# Altium schematic sheet Display.SchDoc: Display
size 840 x 593 mm; Author: James Bao; SheetNumber: 3; SheetTotal: 3
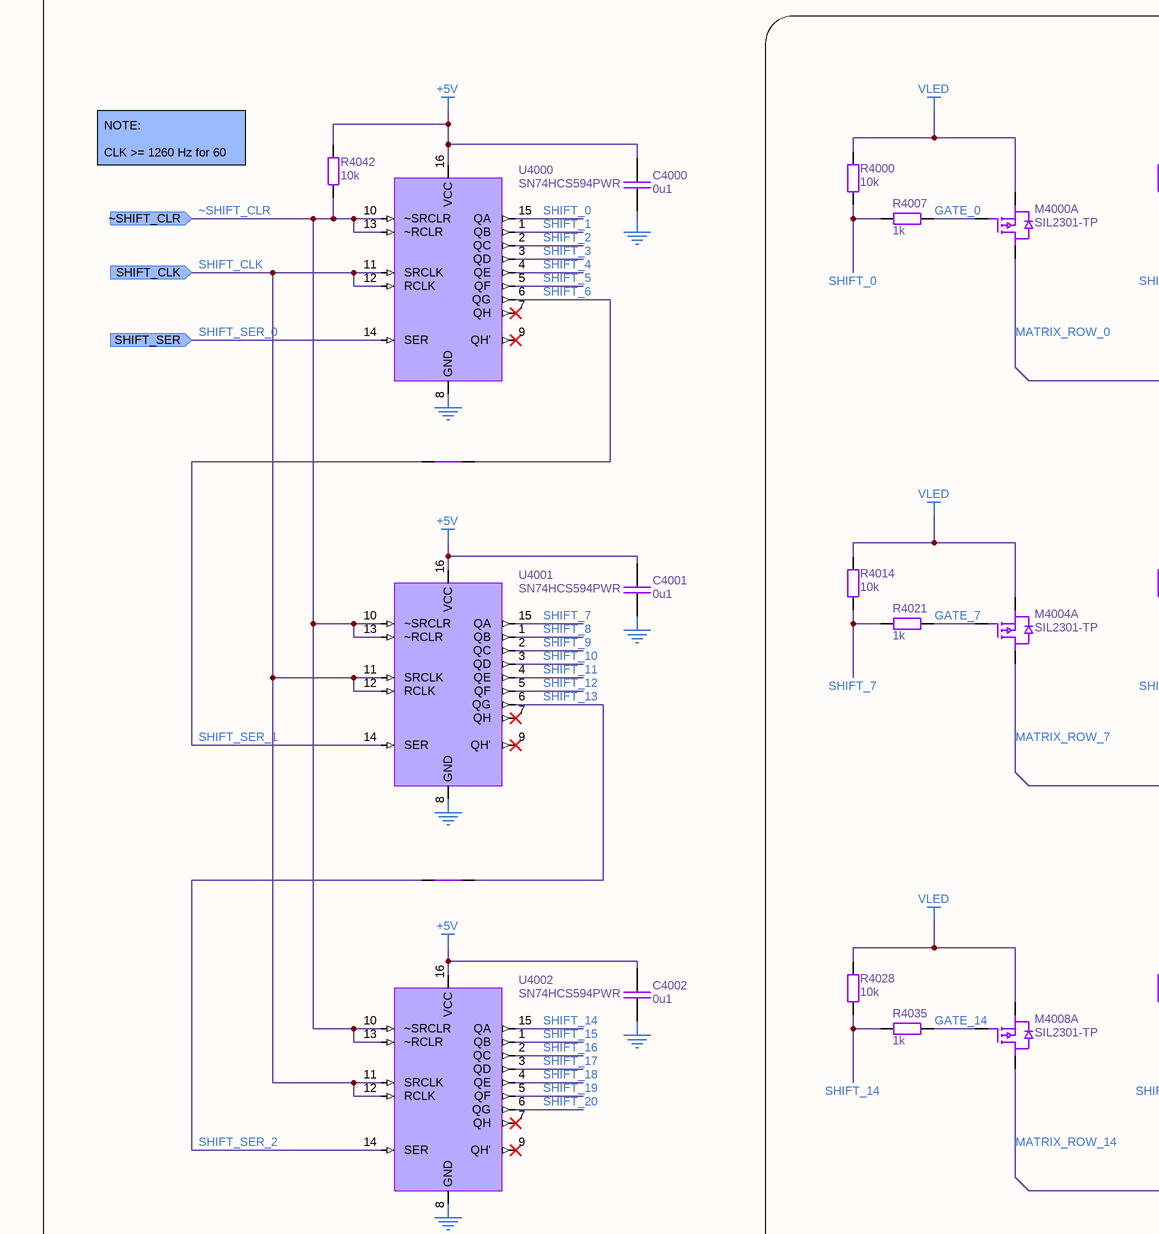
[diagram p0: Display.SchDoc, top left]
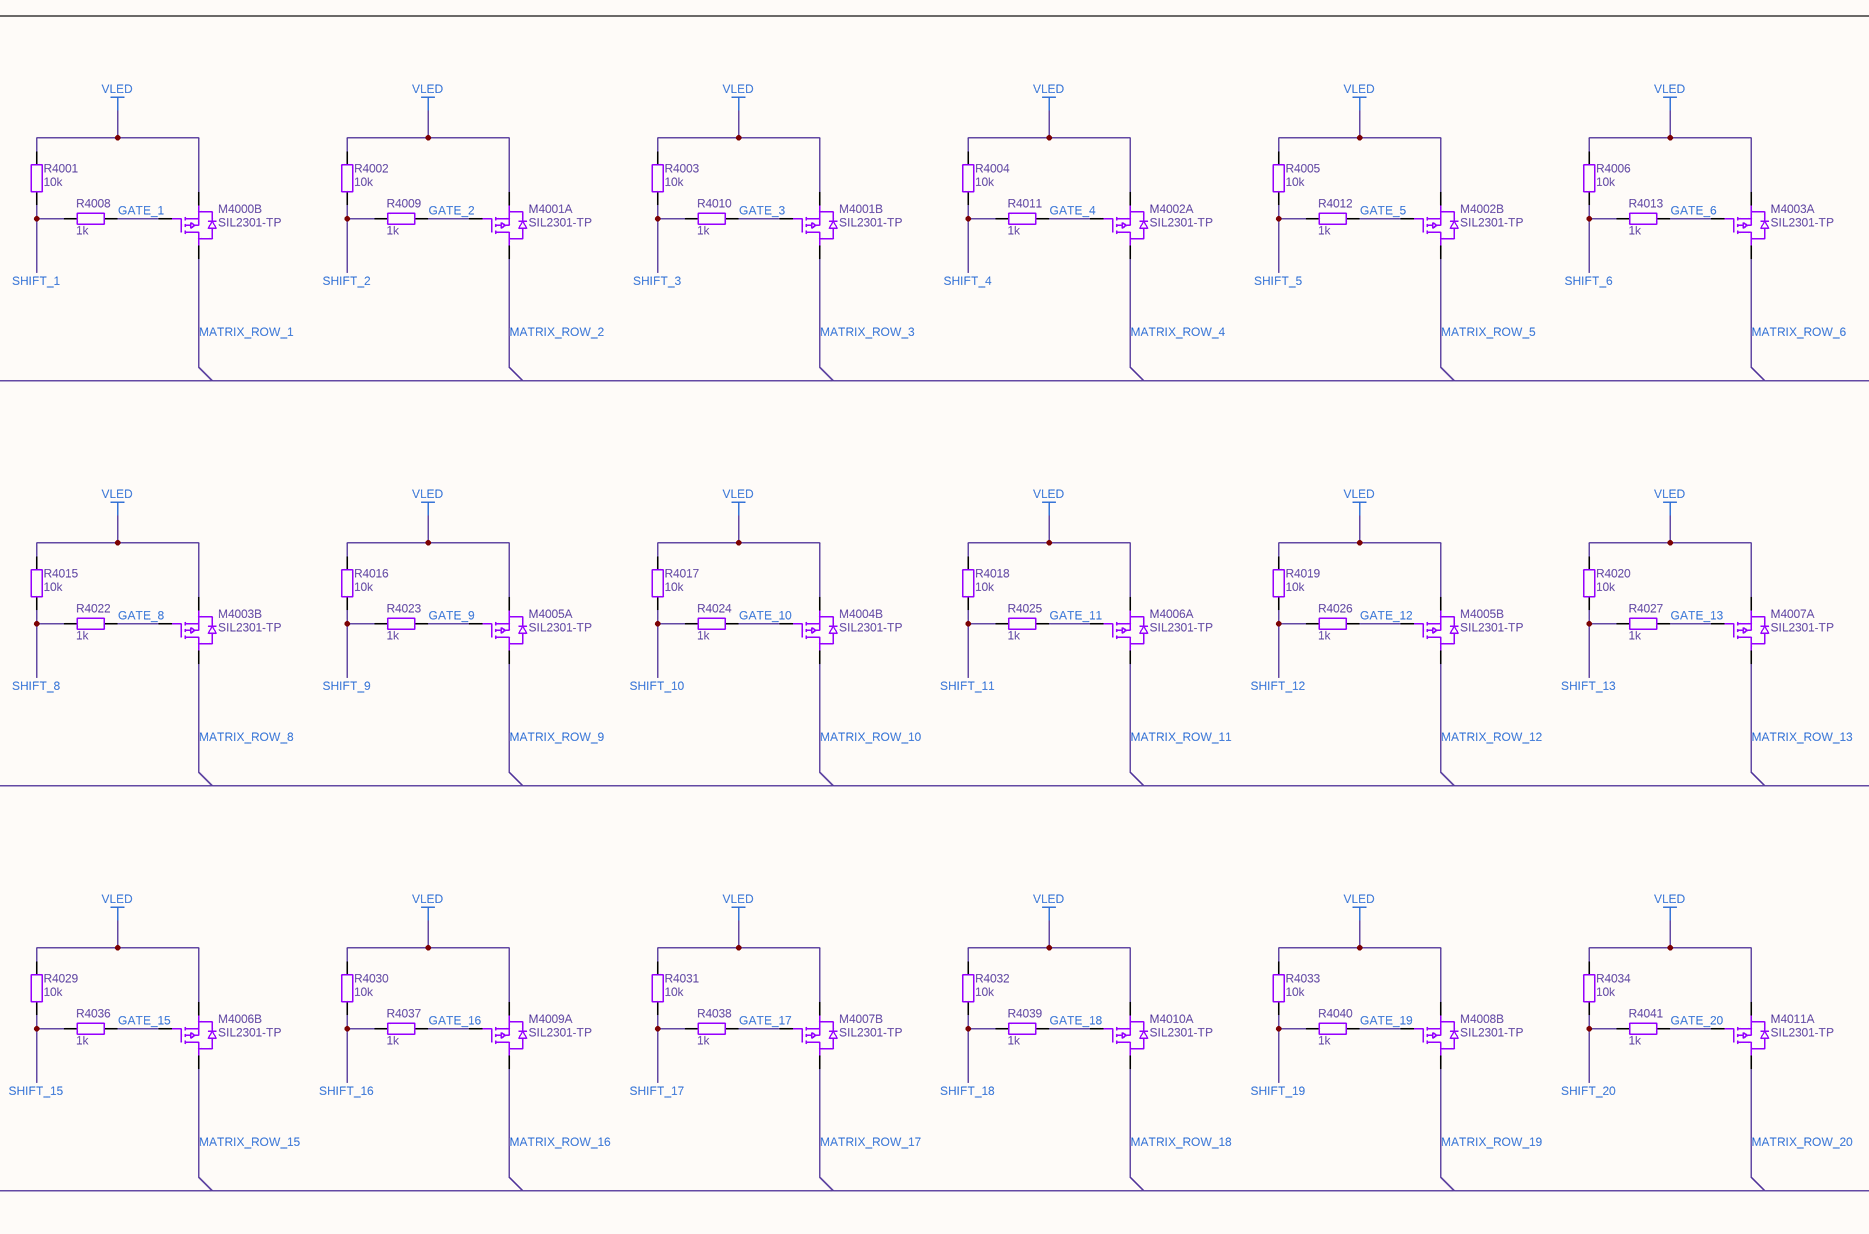
[diagram p1: Display.SchDoc, top middle]
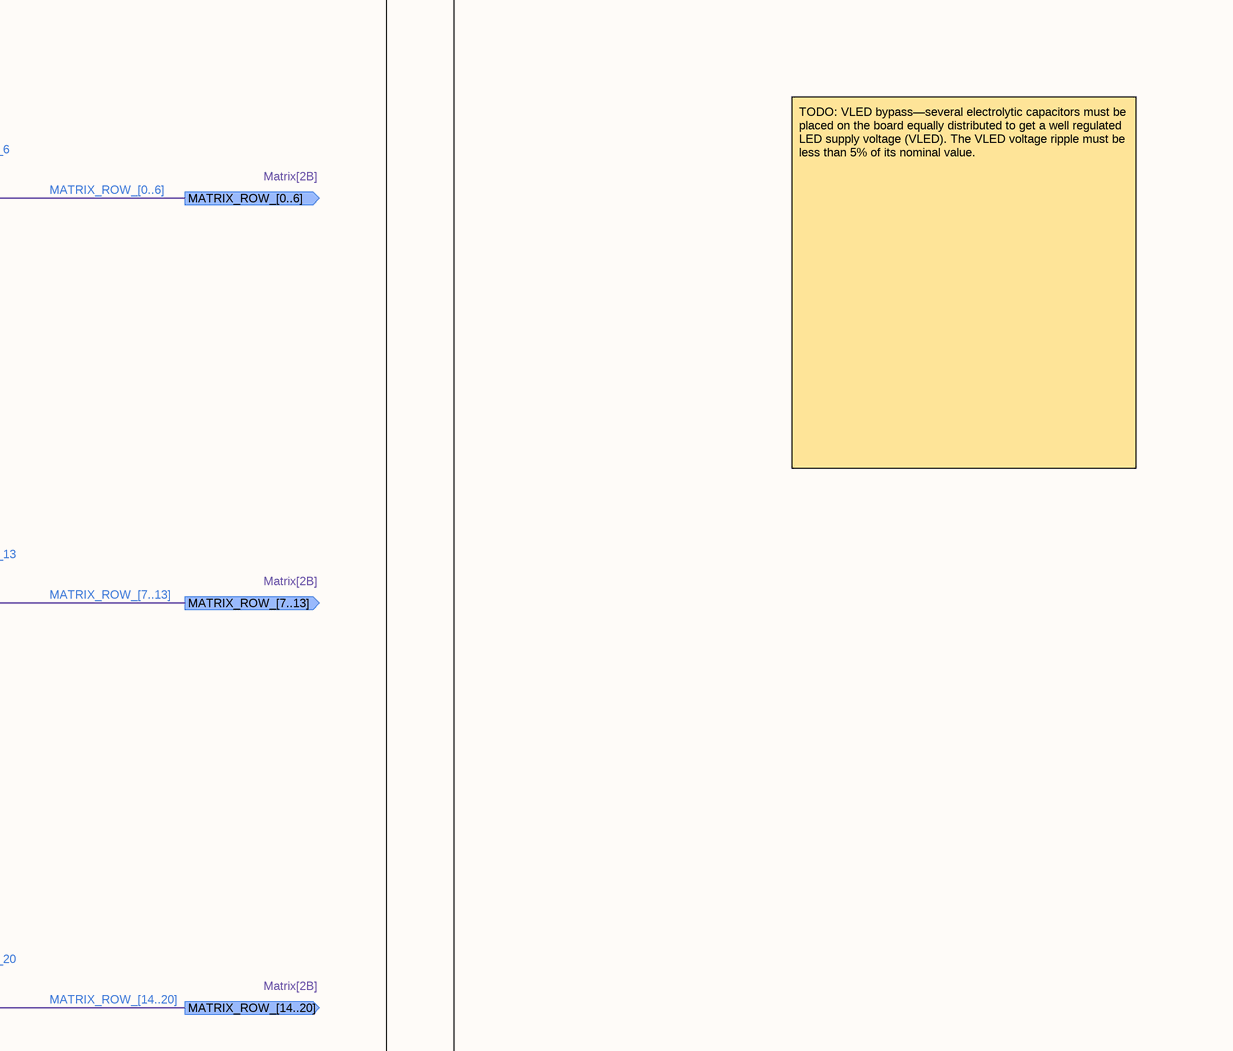
[diagram p2: Display.SchDoc, top right]
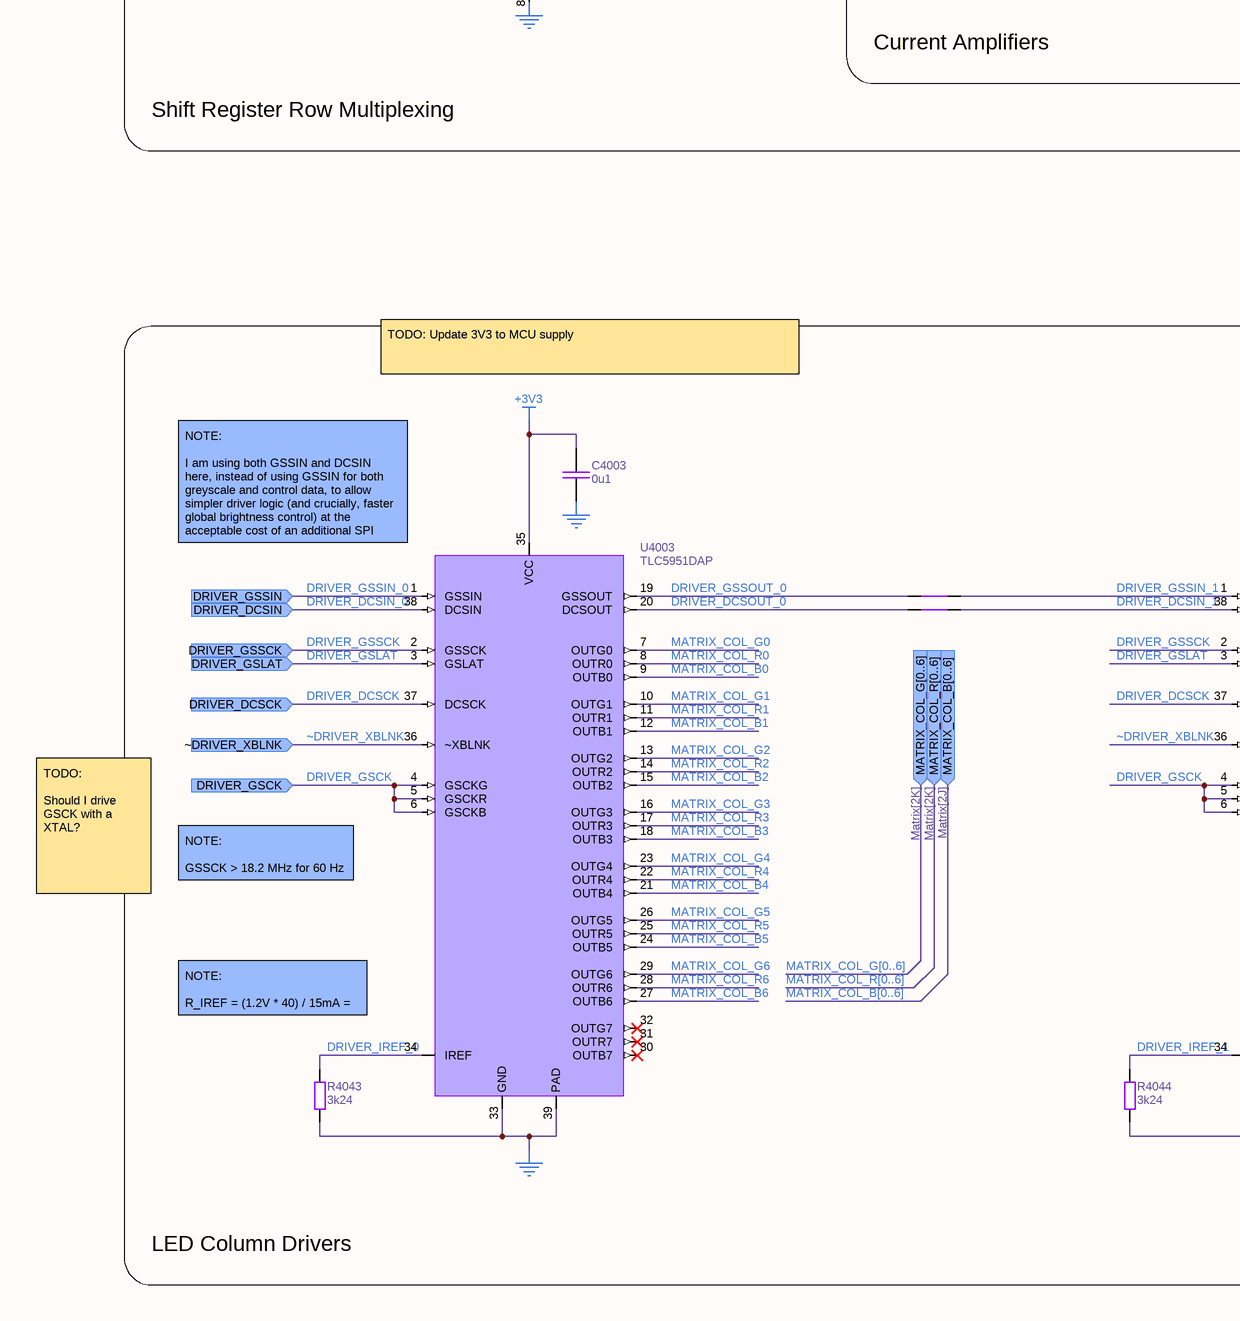
[diagram p3: Display.SchDoc, bottom left]
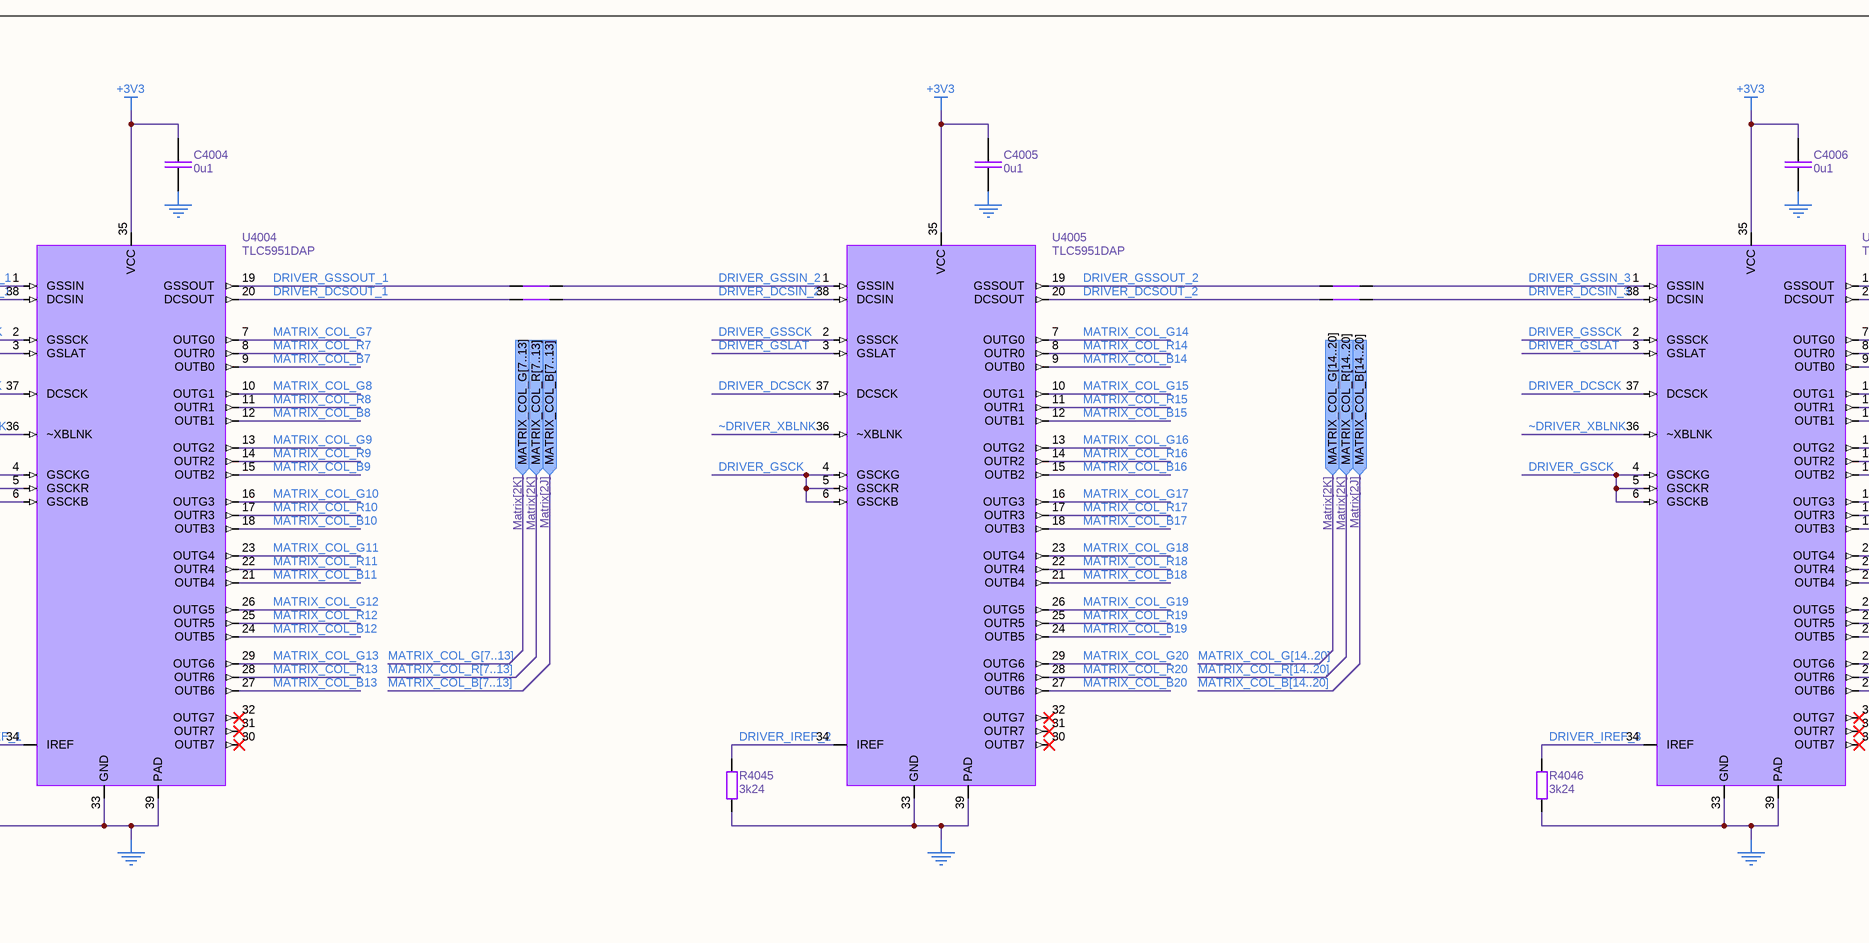
[diagram p4: Display.SchDoc, bottom middle]
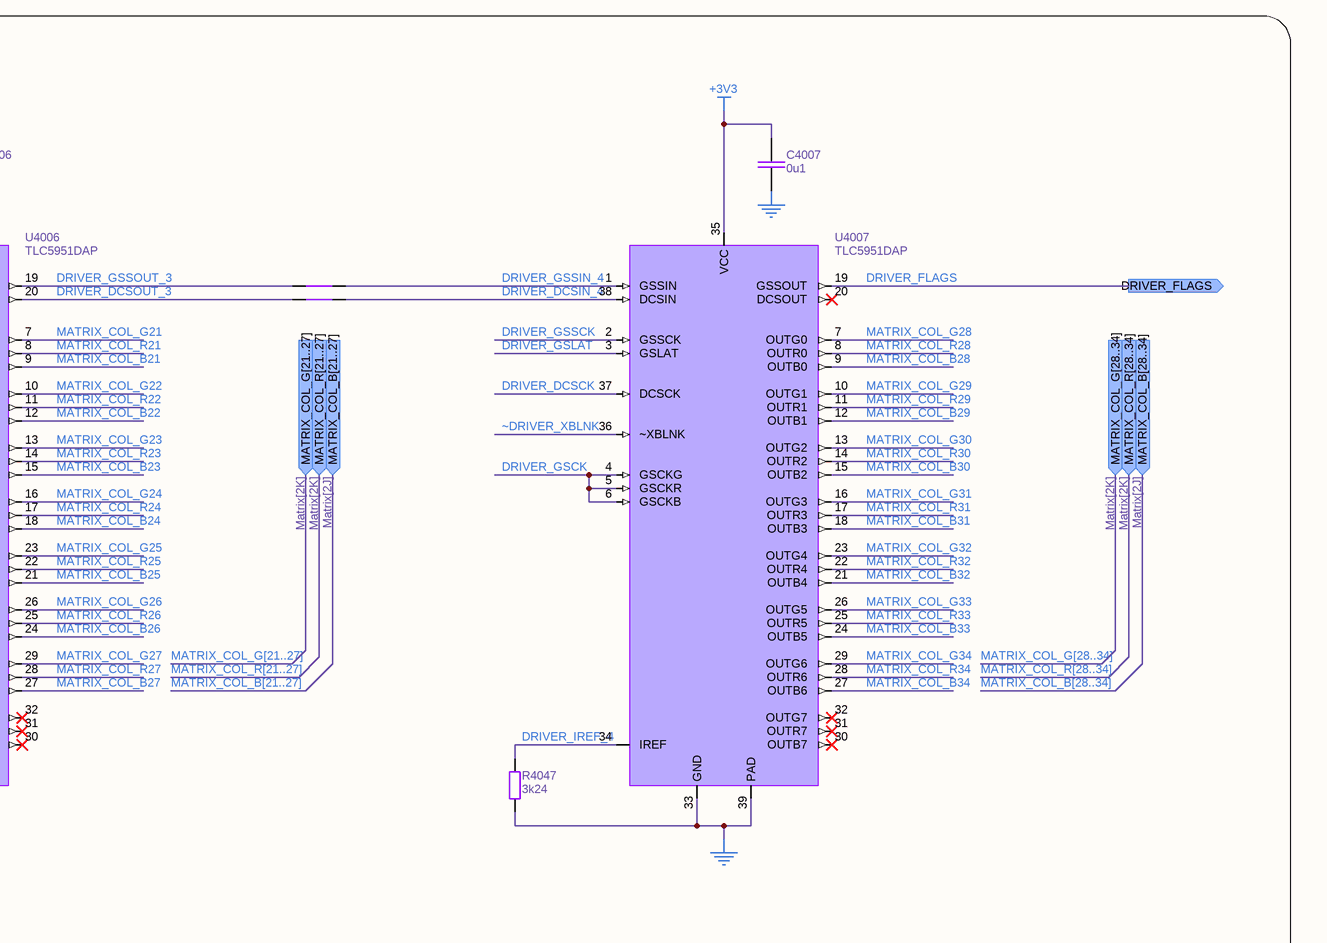
[diagram p5: Display.SchDoc, bottom right]

## Parts
C4000  0u1  [CC0402KRX7R7BB104_SMT_0402]
C4001  0u1  [CC0402KRX7R7BB104_SMT_0402]
C4002  0u1  [CC0402KRX7R7BB104_SMT_0402]
C4003  0u1  [CC0402KRX7R7BB104_SMT_0402]
C4004  0u1  [CC0402KRX7R7BB104_SMT_0402]
C4005  0u1  [CC0402KRX7R7BB104_SMT_0402]
C4006  0u1  [CC0402KRX7R7BB104_SMT_0402]
C4007  0u1  [CC0402KRX7R7BB104_SMT_0402]
M4000  SIL2301-TP  [SIL2301-TP_SMT_SOT23-6L]  (parts A,B of 2)
M4001  SIL2301-TP  [SIL2301-TP_SMT_SOT23-6L]  (parts A,B of 2)
M4002  SIL2301-TP  [SIL2301-TP_SMT_SOT23-6L]  (parts A,B of 2)
M4003  SIL2301-TP  [SIL2301-TP_SMT_SOT23-6L]  (parts A,B of 2)
M4004  SIL2301-TP  [SIL2301-TP_SMT_SOT23-6L]  (parts A,B of 2)
M4005  SIL2301-TP  [SIL2301-TP_SMT_SOT23-6L]  (parts A,B of 2)
M4006  SIL2301-TP  [SIL2301-TP_SMT_SOT23-6L]  (parts A,B of 2)
M4007  SIL2301-TP  [SIL2301-TP_SMT_SOT23-6L]  (parts A,B of 2)
M4008  SIL2301-TP  [SIL2301-TP_SMT_SOT23-6L]  (parts A,B of 2)
M4009  SIL2301-TP  [SIL2301-TP_SMT_SOT23-6L]  (part A of 2)
M4010  SIL2301-TP  [SIL2301-TP_SMT_SOT23-6L]  (part A of 2)
M4011  SIL2301-TP  [SIL2301-TP_SMT_SOT23-6L]  (part A of 2)
NT4000  NT  [NetTie_SMT]  (value not drawn)  (net tie, no BOM)
NT4001  NT  [NetTie_SMT]  (value not drawn)  (net tie, no BOM)
NT4002  NT  [NetTie_SMT]  (value not drawn)  (net tie, no BOM)
NT4003  NT  [NetTie_SMT]  (value not drawn)  (net tie, no BOM)
NT4004  NT  [NetTie_SMT]  (value not drawn)  (net tie, no BOM)
NT4005  NT  [NetTie_SMT]  (value not drawn)  (net tie, no BOM)
NT4006  NT  [NetTie_SMT]  (value not drawn)  (net tie, no BOM)
NT4007  NT  [NetTie_SMT]  (value not drawn)  (net tie, no BOM)
NT4008  NT  [NetTie_SMT]  (value not drawn)  (net tie, no BOM)
NT4009  NT  [NetTie_SMT]  (value not drawn)  (net tie, no BOM)
R4000  10k  [RC0402FR-0710KP_SMT_0402]
R4001  10k  [RC0402FR-0710KP_SMT_0402]
R4002  10k  [RC0402FR-0710KP_SMT_0402]
R4003  10k  [RC0402FR-0710KP_SMT_0402]
R4004  10k  [RC0402FR-0710KP_SMT_0402]
R4005  10k  [RC0402FR-0710KP_SMT_0402]
R4006  10k  [RC0402FR-0710KP_SMT_0402]
R4007  1k  [RC0402FR-071KL_SMT_0402]
R4008  1k  [RC0402FR-071KL_SMT_0402]
R4009  1k  [RC0402FR-071KL_SMT_0402]
R4010  1k  [RC0402FR-071KL_SMT_0402]
R4011  1k  [RC0402FR-071KL_SMT_0402]
R4012  1k  [RC0402FR-071KL_SMT_0402]
R4013  1k  [RC0402FR-071KL_SMT_0402]
R4014  10k  [RC0402FR-0710KP_SMT_0402]
R4015  10k  [RC0402FR-0710KP_SMT_0402]
R4016  10k  [RC0402FR-0710KP_SMT_0402]
R4017  10k  [RC0402FR-0710KP_SMT_0402]
R4018  10k  [RC0402FR-0710KP_SMT_0402]
R4019  10k  [RC0402FR-0710KP_SMT_0402]
R4020  10k  [RC0402FR-0710KP_SMT_0402]
R4021  1k  [RC0402FR-071KL_SMT_0402]
R4022  1k  [RC0402FR-071KL_SMT_0402]
R4023  1k  [RC0402FR-071KL_SMT_0402]
R4024  1k  [RC0402FR-071KL_SMT_0402]
R4025  1k  [RC0402FR-071KL_SMT_0402]
R4026  1k  [RC0402FR-071KL_SMT_0402]
R4027  1k  [RC0402FR-071KL_SMT_0402]
R4028  10k  [RC0402FR-0710KP_SMT_0402]
R4029  10k  [RC0402FR-0710KP_SMT_0402]
R4030  10k  [RC0402FR-0710KP_SMT_0402]
R4031  10k  [RC0402FR-0710KP_SMT_0402]
R4032  10k  [RC0402FR-0710KP_SMT_0402]
R4033  10k  [RC0402FR-0710KP_SMT_0402]
R4034  10k  [RC0402FR-0710KP_SMT_0402]
R4035  1k  [RC0402FR-071KL_SMT_0402]
R4036  1k  [RC0402FR-071KL_SMT_0402]
R4037  1k  [RC0402FR-071KL_SMT_0402]
R4038  1k  [RC0402FR-071KL_SMT_0402]
R4039  1k  [RC0402FR-071KL_SMT_0402]
R4040  1k  [RC0402FR-071KL_SMT_0402]
R4041  1k  [RC0402FR-071KL_SMT_0402]
R4042  10k  [RC0402FR-0710KP_SMT_0402]
R4043  3k24  [RC0402FR-073K24L_SMT_0402]
R4044  3k24  [RC0402FR-073K24L_SMT_0402]
R4045  3k24  [RC0402FR-073K24L_SMT_0402]
R4046  3k24  [RC0402FR-073K24L_SMT_0402]
R4047  3k24  [RC0402FR-073K24L_SMT_0402]
U4000  SN74HCS594PWR  [SN74HCS594PWR_SMT_16-TSSOP]
U4001  SN74HCS594PWR  [SN74HCS594PWR_SMT_16-TSSOP]
U4002  SN74HCS594PWR  [SN74HCS594PWR_SMT_16-TSSOP]
U4003  TLC5951DAP  [TLC5951DAP_SMT_38-HTSSOP]
U4004  TLC5951DAP  [TLC5951DAP_SMT_38-HTSSOP]
U4005  TLC5951DAP  [TLC5951DAP_SMT_38-HTSSOP]
U4006  TLC5951DAP  [TLC5951DAP_SMT_38-HTSSOP]
U4007  TLC5951DAP  [TLC5951DAP_SMT_38-HTSSOP]

## Blocks framed on the sheet
Shift Register Row Multiplexing: C4000-C4002 NT4008 NT4009 R4042 U4000-U4002
Current Amplifiers: M4000-M4011 R4000-R4041
LED Column Drivers: C4003-C4007 NT4000-NT4007 R4043-R4047 U4003-U4007

## Ports
DRIVER_DCSCK (in), DRIVER_DCSIN (in), DRIVER_FLAGS (out), DRIVER_GSCK (in), DRIVER_GSLAT (in), DRIVER_GSSCK (in), DRIVER_GSSIN (in), MATRIX_COL_B[0..6] (in, see Matrix[2J]), MATRIX_COL_B[7..13] (in, see Matrix[2J]), MATRIX_COL_B[14..20] (in, see Matrix[2J]), MATRIX_COL_B[21..27] (in, see Matrix[2J]), MATRIX_COL_B[28..34] (in, see Matrix[2J]), MATRIX_COL_G[0..6] (in, see Matrix[2K]), MATRIX_COL_G[7..13] (in, see Matrix[2K]), MATRIX_COL_G[14..20] (in, see Matrix[2K]), MATRIX_COL_G[21..27] (in, see Matrix[2K]), MATRIX_COL_G[28..34] (in, see Matrix[2K]), MATRIX_COL_R[0..6] (in, see Matrix[2K]), MATRIX_COL_R[7..13] (in, see Matrix[2K]), MATRIX_COL_R[14..20] (in, see Matrix[2K]), MATRIX_COL_R[21..27] (in, see Matrix[2K]), MATRIX_COL_R[28..34] (in, see Matrix[2K]), MATRIX_ROW_[0..6] (out, see Matrix[2B]), MATRIX_ROW_[7..13] (out, see Matrix[2B]), MATRIX_ROW_[14..20] (out, see Matrix[2B]), SHIFT_CLK (in), SHIFT_SER (in), ~DRIVER_XBLNK (in), ~SHIFT_CLR (in)

## Nets
+3V3: C4003.2 C4004.2 C4005.2 C4006.2 C4007.2 U4003.35(VCC) U4004.35(VCC) U4005.35(VCC) U4006.35(VCC) U4007.35(VCC)
+5V: C4000.2 C4001.2 C4002.2 R4042.2 U4000.16(VCC) U4001.16(VCC) U4002.16(VCC)
GND: C4000.1 C4001.1 C4002.1 C4003.1 C4004.1 C4005.1 C4006.1 C4007.1 R4043.1 R4044.1 R4045.1 R4046.1 R4047.1 U4000.8(GND) U4001.8(GND) U4002.8(GND) U4003.33(GND) U4003.39(PAD) U4004.33(GND) U4004.39(PAD) U4005.33(GND) U4005.39(PAD) U4006.33(GND) U4006.39(PAD) U4007.33(GND) U4007.39(PAD)
VLED: M4000.2(Source) M4000.5(Source) M4001.2(Source) M4001.5(Source) M4002.2(Source) M4002.5(Source) M4003.2(Source) M4003.5(Source) M4004.2(Source) M4004.5(Source) M4005.2(Source) M4005.5(Source) M4006.2(Source) M4006.5(Source) M4007.2(Source) M4007.5(Source) M4008.2(Source) M4008.5(Source) M4009.5(Source) M4010.5(Source) M4011.5(Source) R4000.2 R4001.2 R4002.2 R4003.2 R4004.2 R4005.2 R4006.2 R4014.2 R4015.2 R4016.2 R4017.2 R4018.2 R4019.2 R4020.2 R4028.2 R4029.2 R4030.2 R4031.2 R4032.2 R4033.2 R4034.2
DRIVER_DCSCK: U4003.37(DCSCK) U4004.37(DCSCK) U4005.37(DCSCK) U4006.37(DCSCK) U4007.37(DCSCK) ; port DRIVER_DCSCK
DRIVER_DCSIN_0: U4003.38(DCSIN) ; port DRIVER_DCSIN
DRIVER_DCSIN_1: NT4004.2 U4004.38(DCSIN)
DRIVER_DCSIN_2: NT4005.2 U4005.38(DCSIN)
DRIVER_DCSIN_3: NT4006.2 U4006.38(DCSIN)
DRIVER_DCSIN_4: NT4007.2 U4007.38(DCSIN)
DRIVER_DCSOUT_0: NT4004.1 U4003.20(DCSOUT)
DRIVER_DCSOUT_1: NT4005.1 U4004.20(DCSOUT)
DRIVER_DCSOUT_2: NT4006.1 U4005.20(DCSOUT)
DRIVER_DCSOUT_3: NT4007.1 U4006.20(DCSOUT)
DRIVER_FLAGS: U4007.19(GSSOUT) ; port DRIVER_FLAGS
DRIVER_GSCK: U4003.4(GSCKG) U4003.5(GSCKR) U4003.6(GSCKB) U4004.4(GSCKG) U4004.5(GSCKR) U4004.6(GSCKB) U4005.4(GSCKG) U4005.5(GSCKR) U4005.6(GSCKB) U4006.4(GSCKG) U4006.5(GSCKR) U4006.6(GSCKB) U4007.4(GSCKG) U4007.5(GSCKR) U4007.6(GSCKB) ; port DRIVER_GSCK
DRIVER_GSLAT: U4003.3(GSLAT) U4004.3(GSLAT) U4005.3(GSLAT) U4006.3(GSLAT) U4007.3(GSLAT) ; port DRIVER_GSLAT
DRIVER_GSSCK: U4003.2(GSSCK) U4004.2(GSSCK) U4005.2(GSSCK) U4006.2(GSSCK) U4007.2(GSSCK) ; port DRIVER_GSSCK
DRIVER_GSSIN_0: U4003.1(GSSIN) ; port DRIVER_GSSIN
DRIVER_GSSIN_1: NT4000.2 U4004.1(GSSIN)
DRIVER_GSSIN_2: NT4001.2 U4005.1(GSSIN)
DRIVER_GSSIN_3: NT4002.2 U4006.1(GSSIN)
DRIVER_GSSIN_4: NT4003.2 U4007.1(GSSIN)
DRIVER_GSSOUT_0: NT4000.1 U4003.19(GSSOUT)
DRIVER_GSSOUT_1: NT4001.1 U4004.19(GSSOUT)
DRIVER_GSSOUT_2: NT4002.1 U4005.19(GSSOUT)
DRIVER_GSSOUT_3: NT4003.1 U4006.19(GSSOUT)
DRIVER_IREF_0: R4043.2 U4003.34(IREF)
DRIVER_IREF_1: R4044.2 U4004.34(IREF)
DRIVER_IREF_2: R4045.2 U4005.34(IREF)
DRIVER_IREF_3: R4046.2 U4006.34(IREF)
DRIVER_IREF_4: R4047.2 U4007.34(IREF)
GATE_0: M4000.1(Gate) R4007.2
GATE_1: M4000.3(Gate) R4008.2
GATE_2: M4001.1(Gate) R4009.2
GATE_3: M4001.3(Gate) R4010.2
GATE_4: M4002.1(Gate) R4011.2
GATE_5: M4002.3(Gate) R4012.2
GATE_6: M4003.1(Gate) R4013.2
GATE_7: M4004.1(Gate) R4021.2
GATE_8: M4003.3(Gate) R4022.2
GATE_9: M4005.1(Gate) R4023.2
GATE_10: M4004.3(Gate) R4024.2
GATE_11: M4006.1(Gate) R4025.2
GATE_12: M4005.3(Gate) R4026.2
GATE_13: M4007.1(Gate) R4027.2
GATE_14: M4008.1(Gate) R4035.2
GATE_15: M4006.3(Gate) R4036.2
GATE_16: M4009.1(Gate) R4037.2
GATE_17: M4007.3(Gate) R4038.2
GATE_18: M4010.1(Gate) R4039.2
GATE_19: M4008.3(Gate) R4040.2
GATE_20: M4011.1(Gate) R4041.2
MATRIX_COL_B0: U4003.9(OUTB0)
MATRIX_COL_B1: U4003.12(OUTB1)
MATRIX_COL_B2: U4003.15(OUTB2)
MATRIX_COL_B3: U4003.18(OUTB3)
MATRIX_COL_B4: U4003.21(OUTB4)
MATRIX_COL_B5: U4003.24(OUTB5)
MATRIX_COL_B6: U4003.27(OUTB6)
MATRIX_COL_B7: U4004.9(OUTB0)
MATRIX_COL_B8: U4004.12(OUTB1)
MATRIX_COL_B9: U4004.15(OUTB2)
MATRIX_COL_B10: U4004.18(OUTB3)
MATRIX_COL_B11: U4004.21(OUTB4)
MATRIX_COL_B12: U4004.24(OUTB5)
MATRIX_COL_B13: U4004.27(OUTB6)
MATRIX_COL_B14: U4005.9(OUTB0)
MATRIX_COL_B15: U4005.12(OUTB1)
MATRIX_COL_B16: U4005.15(OUTB2)
MATRIX_COL_B17: U4005.18(OUTB3)
MATRIX_COL_B18: U4005.21(OUTB4)
MATRIX_COL_B19: U4005.24(OUTB5)
MATRIX_COL_B20: U4005.27(OUTB6)
MATRIX_COL_B21: U4006.9(OUTB0)
MATRIX_COL_B22: U4006.12(OUTB1)
MATRIX_COL_B23: U4006.15(OUTB2)
MATRIX_COL_B24: U4006.18(OUTB3)
MATRIX_COL_B25: U4006.21(OUTB4)
MATRIX_COL_B26: U4006.24(OUTB5)
MATRIX_COL_B27: U4006.27(OUTB6)
MATRIX_COL_B28: U4007.9(OUTB0)
MATRIX_COL_B29: U4007.12(OUTB1)
MATRIX_COL_B30: U4007.15(OUTB2)
MATRIX_COL_B31: U4007.18(OUTB3)
MATRIX_COL_B32: U4007.21(OUTB4)
MATRIX_COL_B33: U4007.24(OUTB5)
MATRIX_COL_B34: U4007.27(OUTB6)
MATRIX_COL_G0: U4003.7(OUTG0)
MATRIX_COL_G1: U4003.10(OUTG1)
MATRIX_COL_G2: U4003.13(OUTG2)
MATRIX_COL_G3: U4003.16(OUTG3)
MATRIX_COL_G4: U4003.23(OUTG4)
MATRIX_COL_G5: U4003.26(OUTG5)
MATRIX_COL_G6: U4003.29(OUTG6)
MATRIX_COL_G7: U4004.7(OUTG0)
MATRIX_COL_G8: U4004.10(OUTG1)
MATRIX_COL_G9: U4004.13(OUTG2)
MATRIX_COL_G10: U4004.16(OUTG3)
MATRIX_COL_G11: U4004.23(OUTG4)
MATRIX_COL_G12: U4004.26(OUTG5)
MATRIX_COL_G13: U4004.29(OUTG6)
MATRIX_COL_G14: U4005.7(OUTG0)
MATRIX_COL_G15: U4005.10(OUTG1)
MATRIX_COL_G16: U4005.13(OUTG2)
MATRIX_COL_G17: U4005.16(OUTG3)
MATRIX_COL_G18: U4005.23(OUTG4)
MATRIX_COL_G19: U4005.26(OUTG5)
MATRIX_COL_G20: U4005.29(OUTG6)
MATRIX_COL_G21: U4006.7(OUTG0)
MATRIX_COL_G22: U4006.10(OUTG1)
MATRIX_COL_G23: U4006.13(OUTG2)
MATRIX_COL_G24: U4006.16(OUTG3)
MATRIX_COL_G25: U4006.23(OUTG4)
MATRIX_COL_G26: U4006.26(OUTG5)
MATRIX_COL_G27: U4006.29(OUTG6)
MATRIX_COL_G28: U4007.7(OUTG0)
MATRIX_COL_G29: U4007.10(OUTG1)
MATRIX_COL_G30: U4007.13(OUTG2)
MATRIX_COL_G31: U4007.16(OUTG3)
MATRIX_COL_G32: U4007.23(OUTG4)
MATRIX_COL_G33: U4007.26(OUTG5)
MATRIX_COL_G34: U4007.29(OUTG6)
MATRIX_COL_R0: U4003.8(OUTR0)
MATRIX_COL_R1: U4003.11(OUTR1)
MATRIX_COL_R2: U4003.14(OUTR2)
MATRIX_COL_R3: U4003.17(OUTR3)
MATRIX_COL_R4: U4003.22(OUTR4)
MATRIX_COL_R5: U4003.25(OUTR5)
MATRIX_COL_R6: U4003.28(OUTR6)
MATRIX_COL_R7: U4004.8(OUTR0)
MATRIX_COL_R8: U4004.11(OUTR1)
MATRIX_COL_R9: U4004.14(OUTR2)
MATRIX_COL_R10: U4004.17(OUTR3)
MATRIX_COL_R11: U4004.22(OUTR4)
MATRIX_COL_R12: U4004.25(OUTR5)
MATRIX_COL_R13: U4004.28(OUTR6)
MATRIX_COL_R14: U4005.8(OUTR0)
MATRIX_COL_R15: U4005.11(OUTR1)
MATRIX_COL_R16: U4005.14(OUTR2)
MATRIX_COL_R17: U4005.17(OUTR3)
MATRIX_COL_R18: U4005.22(OUTR4)
MATRIX_COL_R19: U4005.25(OUTR5)
MATRIX_COL_R20: U4005.28(OUTR6)
MATRIX_COL_R21: U4006.8(OUTR0)
MATRIX_COL_R22: U4006.11(OUTR1)
MATRIX_COL_R23: U4006.14(OUTR2)
MATRIX_COL_R24: U4006.17(OUTR3)
MATRIX_COL_R25: U4006.22(OUTR4)
MATRIX_COL_R26: U4006.25(OUTR5)
MATRIX_COL_R27: U4006.28(OUTR6)
MATRIX_COL_R28: U4007.8(OUTR0)
MATRIX_COL_R29: U4007.11(OUTR1)
MATRIX_COL_R30: U4007.14(OUTR2)
MATRIX_COL_R31: U4007.17(OUTR3)
MATRIX_COL_R32: U4007.22(OUTR4)
MATRIX_COL_R33: U4007.25(OUTR5)
MATRIX_COL_R34: U4007.28(OUTR6)
MATRIX_ROW_0: M4000.6(Drain)
MATRIX_ROW_1: M4000.4(Drain)
MATRIX_ROW_2: M4001.6(Drain)
MATRIX_ROW_3: M4001.4(Drain)
MATRIX_ROW_4: M4002.6(Drain)
MATRIX_ROW_5: M4002.4(Drain)
MATRIX_ROW_6: M4003.6(Drain)
MATRIX_ROW_7: M4004.6(Drain)
MATRIX_ROW_8: M4003.4(Drain)
MATRIX_ROW_9: M4005.6(Drain)
MATRIX_ROW_10: M4004.4(Drain)
MATRIX_ROW_11: M4006.6(Drain)
MATRIX_ROW_12: M4005.4(Drain)
MATRIX_ROW_13: M4007.6(Drain)
MATRIX_ROW_14: M4008.6(Drain)
MATRIX_ROW_15: M4006.4(Drain)
MATRIX_ROW_16: M4009.6(Drain)
MATRIX_ROW_17: M4007.4(Drain)
MATRIX_ROW_18: M4010.6(Drain)
MATRIX_ROW_19: M4008.4(Drain)
MATRIX_ROW_20: M4011.6(Drain)
SHIFT_0: R4000.1 R4007.1 U4000.15(QA)
SHIFT_1: R4001.1 R4008.1 U4000.1(QB)
SHIFT_2: R4002.1 R4009.1 U4000.2(QC)
SHIFT_3: R4003.1 R4010.1 U4000.3(QD)
SHIFT_4: R4004.1 R4011.1 U4000.4(QE)
SHIFT_5: R4005.1 R4012.1 U4000.5(QF)
SHIFT_6: NT4008.2 R4006.1 R4013.1 U4000.6(QG)
SHIFT_7: R4014.1 R4021.1 U4001.15(QA)
SHIFT_8: R4015.1 R4022.1 U4001.1(QB)
SHIFT_9: R4016.1 R4023.1 U4001.2(QC)
SHIFT_10: R4017.1 R4024.1 U4001.3(QD)
SHIFT_11: R4018.1 R4025.1 U4001.4(QE)
SHIFT_12: R4019.1 R4026.1 U4001.5(QF)
SHIFT_13: NT4009.2 R4020.1 R4027.1 U4001.6(QG)
SHIFT_14: R4028.1 R4035.1 U4002.15(QA)
SHIFT_15: R4029.1 R4036.1 U4002.1(QB)
SHIFT_16: R4030.1 R4037.1 U4002.2(QC)
SHIFT_17: R4031.1 R4038.1 U4002.3(QD)
SHIFT_18: R4032.1 R4039.1 U4002.4(QE)
SHIFT_19: R4033.1 R4040.1 U4002.5(QF)
SHIFT_20: R4034.1 R4041.1 U4002.6(QG)
SHIFT_CLK: U4000.11(SRCLK) U4000.12(RCLK) U4001.11(SRCLK) U4001.12(RCLK) U4002.11(SRCLK) U4002.12(RCLK) ; port SHIFT_CLK
SHIFT_SER_0: U4000.14(SER) ; port SHIFT_SER
SHIFT_SER_1: NT4008.1 U4001.14(SER)
SHIFT_SER_2: NT4009.1 U4002.14(SER)
~DRIVER_XBLNK: U4003.36(~XBLNK) U4004.36(~XBLNK) U4005.36(~XBLNK) U4006.36(~XBLNK) U4007.36(~XBLNK) ; port ~DRIVER_XBLNK
~SHIFT_CLR: R4042.1 U4000.10(~SRCLR) U4000.13(~RCLR) U4001.10(~SRCLR) U4001.13(~RCLR) U4002.10(~SRCLR) U4002.13(~RCLR) ; port ~SHIFT_CLR

Not connected (* = marked no-connect by the designer): U4000 7(QH)* 9(QH')*; U4001 7(QH)* 9(QH')*; U4002 7(QH)* 9(QH')*; U4003 30(OUTB7)* 31(OUTR7)* 32(OUTG7)*; U4004 30(OUTB7)* 31(OUTR7)* 32(OUTG7)*; U4005 30(OUTB7)* 31(OUTR7)* 32(OUTG7)*; U4006 30(OUTB7)* 31(OUTR7)* 32(OUTG7)*; U4007 20(DCSOUT)* 30(OUTB7)* 31(OUTR7)* 32(OUTG7)*

## Buses and harness runs
bus MATRIX_COL_B[0..6] = port MATRIX_COL_B[0..6]
bus MATRIX_COL_B[7..13] = port MATRIX_COL_B[7..13]
bus MATRIX_COL_B[14..20] = port MATRIX_COL_B[14..20]
bus MATRIX_COL_B[21..27] = port MATRIX_COL_B[21..27]
bus MATRIX_COL_B[28..34] = port MATRIX_COL_B[28..34]
bus MATRIX_COL_G[0..6] = port MATRIX_COL_G[0..6]
bus MATRIX_COL_G[7..13] = port MATRIX_COL_G[7..13]
bus MATRIX_COL_G[14..20] = port MATRIX_COL_G[14..20]
bus MATRIX_COL_G[21..27] = port MATRIX_COL_G[21..27]
bus MATRIX_COL_G[28..34] = port MATRIX_COL_G[28..34]
bus MATRIX_COL_R[0..6] = port MATRIX_COL_R[0..6]
bus MATRIX_COL_R[7..13] = port MATRIX_COL_R[7..13]
bus MATRIX_COL_R[14..20] = port MATRIX_COL_R[14..20]
bus MATRIX_COL_R[21..27] = port MATRIX_COL_R[21..27]
bus MATRIX_COL_R[28..34] = port MATRIX_COL_R[28..34]
bus MATRIX_ROW_[0..6] = port MATRIX_ROW_[0..6]
bus MATRIX_ROW_[7..13] = port MATRIX_ROW_[7..13]
bus MATRIX_ROW_[14..20] = port MATRIX_ROW_[14..20]

## Notes on the sheet
- NOTE:
  CLK >= 1260 Hz for 60 Hz
- TODO: VLED bypass—several electrolytic capacitors must be placed on the board equally distributed to get a well regulated LED supply voltage (VLED). The VLED voltage ripple must be less than 5% of its nominal value.
- TODO: Update 3V3 to MCU supply
- (near U4003) NOTE:
  I am using both GSSIN and DCSIN here, instead of using GSSIN for both greyscale and control data, to allow simpler driver logic (and crucially, faster global brightness control) at the acceptable cost of an additional SPI peripheral.
- TODO:
  Should I drive GSCK with a XTAL?
- NOTE:
  GSSCK > 18.2 MHz for 60 Hz
- NOTE:
  R_IREF = (1.2V * 40) / 15mA = 3k2R
- Project
- algovision
- Document
- Project Revision
- Date
- Time
- Document Revision
- Sheet
- of
- Revision
- File

## Library data of the parts
C4000-C4007 = CC0402KRX7R7BB104_SMT_0402: 0402 SMT 0u1 16V X7R ceramic capacitor; Manufacturer: YAGEO; Manufacturer Part Number: CC0402KRX7R7BB104; Supplier: DigiKey; Supplier Part Number: 311-1338; Package: 0402; Height (Max): 0.55; ComponentLink1Description: Datasheet; ComponentLink1URL: https://www.yageo.com/upload/media/product/productsearch/datasheet/mlcc/UPY-GPHC_X7R_6.3V-to-250V_23.pdf; ComponentLink2Description: Supplier Link; ComponentLink2URL: https://www.digikey.co.nz/en/products/detail/yageo/CC0402KRX7R7BB104/2103076
M4000-M4011 = SIL2301-TP_SMT_SOT23-6L: SOT23-6L SMT dual P-channel MOSFET; Manufacturer: Micro Commercial Components; Manufacturer Part Number: SIL2301-TP; Supplier: DigiKey; Supplier Part Number: SIL2301-TPMS; Package: SOT23-6L; Height (Max): 1.3; ComponentLink1Description: Datasheet; ComponentLink1URL: https://www.mccsemi.com/pdf/Products/SIL2301(SOT23-6L).pdf; ComponentLink2Description: Supplier Link; ComponentLink2URL: https://www.digikey.co.nz/en/products/detail/micro-commercial-co/SIL2301-TP/9655969
NT4000-NT4009 = NetTie_SMT: Net Tie SMT
R4000-R4006 R4014-R4020 R4028-R4034 R4042 = RC0402FR-0710KP_SMT_0402: 0402 SMT 10k chip resistor; Manufacturer: YAGEO; Manufacturer Part Number: RC0402FR-0710KP; Supplier: DigiKey; Supplier Part Number: YAG1249; Package: 0402; Height (Max): 0.4; ComponentLink1Description: Datasheet; ComponentLink1URL: https://www.yageo.com/upload/media/product/productsearch/datasheet/rchip/PYu-RC_51_RoHS_P_5.pdf; ComponentLink2Description: Supplier Link; ComponentLink2URL: https://www.digikey.co.nz/en/products/detail/yageo/RC0402FR-0710KP/4935264
R4007-R4013 R4021-R4027 R4035-R4041 = RC0402FR-071KL_SMT_0402: 0402 SMT 1k chip resistor; Manufacturer: YAGEO; Manufacturer Part Number: RC0402FR-071KL; Supplier: DigiKey; Supplier Part Number: 311-1.00KLR; Package: 0402; Height (Max): 0.4; ComponentLink1Description: Datasheet; ComponentLink1URL: https://www.yageo.com/upload/media/product/productsearch/datasheet/rchip/PYu-RC_Group_51_RoHS_L_12.pdf; ComponentLink2Description: Supplier Link; ComponentLink2URL: https://www.digikey.co.nz/en/products/detail/yageo/RC0402FR-071KL/726513
R4043-R4047 = RC0402FR-073K24L_SMT_0402: 0402 SMT 3k24 chip resistor; Manufacturer: YAGEO; Manufacturer Part Number: RC0402FR-073K24L; Supplier: DigiKey; Supplier Part Number: YAG3147; Package: 0402; Height (Max): 0.4; ComponentLink1Description: Datasheet; ComponentLink1URL: https://www.yageo.com/upload/media/product/productsearch/datasheet/rchip/PYu-RC_Group_51_RoHS_L_12.pdf; ComponentLink2Description: Supplier Link; ComponentLink2URL: https://www.digikey.co.nz/en/products/detail/yageo/RC0402FR-073K24L/5281007
U4000-U4002 = SN74HCS594PWR_SMT_16-TSSPOP: 16-TSSOP SMT 8 bit shift register; Manufacturer: Texas Instruments; Manufacturer Part Number: SN74HCS594PWR; Supplier: DigiKey; ComponentLink1Description: Datasheet; ComponentLink1URL: https://www.ti.com/lit/ds/symlink/sn74hcs594.pdf; ComponentLink2Description: Supplier Link; ComponentLink2URL: https://www.digikey.co.nz/en/products/detail/texas-instruments/SN74HCS594PWR/13532304; Supplier Part Number: 296-SN74HCS594PWR; Package: 16-TSSOP; Height (Max): 1.2
U4003-U4007 = TLC5951DAP_SMT_38-HTSSOP: 38-HTSSOP SMT 24 output linear shift register LED driver; Manufacturer: Texas Instruments; ComponentLink1Description: Datasheet; ComponentLink1URL: https://www.ti.com/general/docs/suppproductinfo.tsp?distId=10&gotoUrl=https%3A%2F%2Fwww.ti.com%2Flit%2Fgpn%2Ftlc5951; ComponentLink2Description: Supplier Link; ComponentLink2URL: https://www.digikey.co.nz/en/products/detail/texas-instruments/TLC5951DAP/2187574; Manufacturer Part Number: TLC5951DAP; Supplier: DigiKey; Supplier Part Number: 296-25461-5-ND; Package: 38-HTSSOP; Height (Max): 1.2